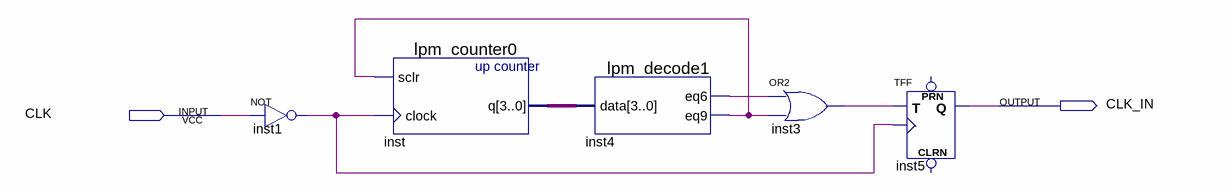
[diagram p0: schematic sheet]
// Quartus schematic lab2block1.bdf as structural Verilog: 5 symbols, 2 pins
module lab2block1 (
  input  CLK,
  output CLK_IN
);

  wire inst1_out, inst3_out, inst4_eq6, inst4_eq9;
  wire [3:0] inst_q;

  not inst1 (inst1_out, CLK);
  lpm_counter0 inst (.sclr(inst4_eq9), .clock(inst1_out), .q(inst_q));
  lpm_decode1 inst4 (.data(inst_q), .eq6(inst4_eq6), .eq9(inst4_eq9));
  or inst3 (inst3_out, inst4_eq6, inst4_eq9);
  TFF inst5 (.T(inst3_out), .CLK(inst1_out), .Q(CLK_IN));  // open: PRN, CLRN
endmodule
